# Altium schematic sheet Rx_syno.SchDoc: Balise IR-Rx - Synoptique
size A3; Author: B Labbe; CompanyName: Oufffteam; DrawnBy: B Labbe; Engineer: B Labbe; Organization: Oufffteam; Address1: L3, 12a Rodborough Rd; Address2: Frenchs Forest; Address3: NSW; Address4: Australia 2086; Revision: B; SheetNumber: 1; SheetTotal: 5; DocumentName: Balise IR-Rx - Synoptique
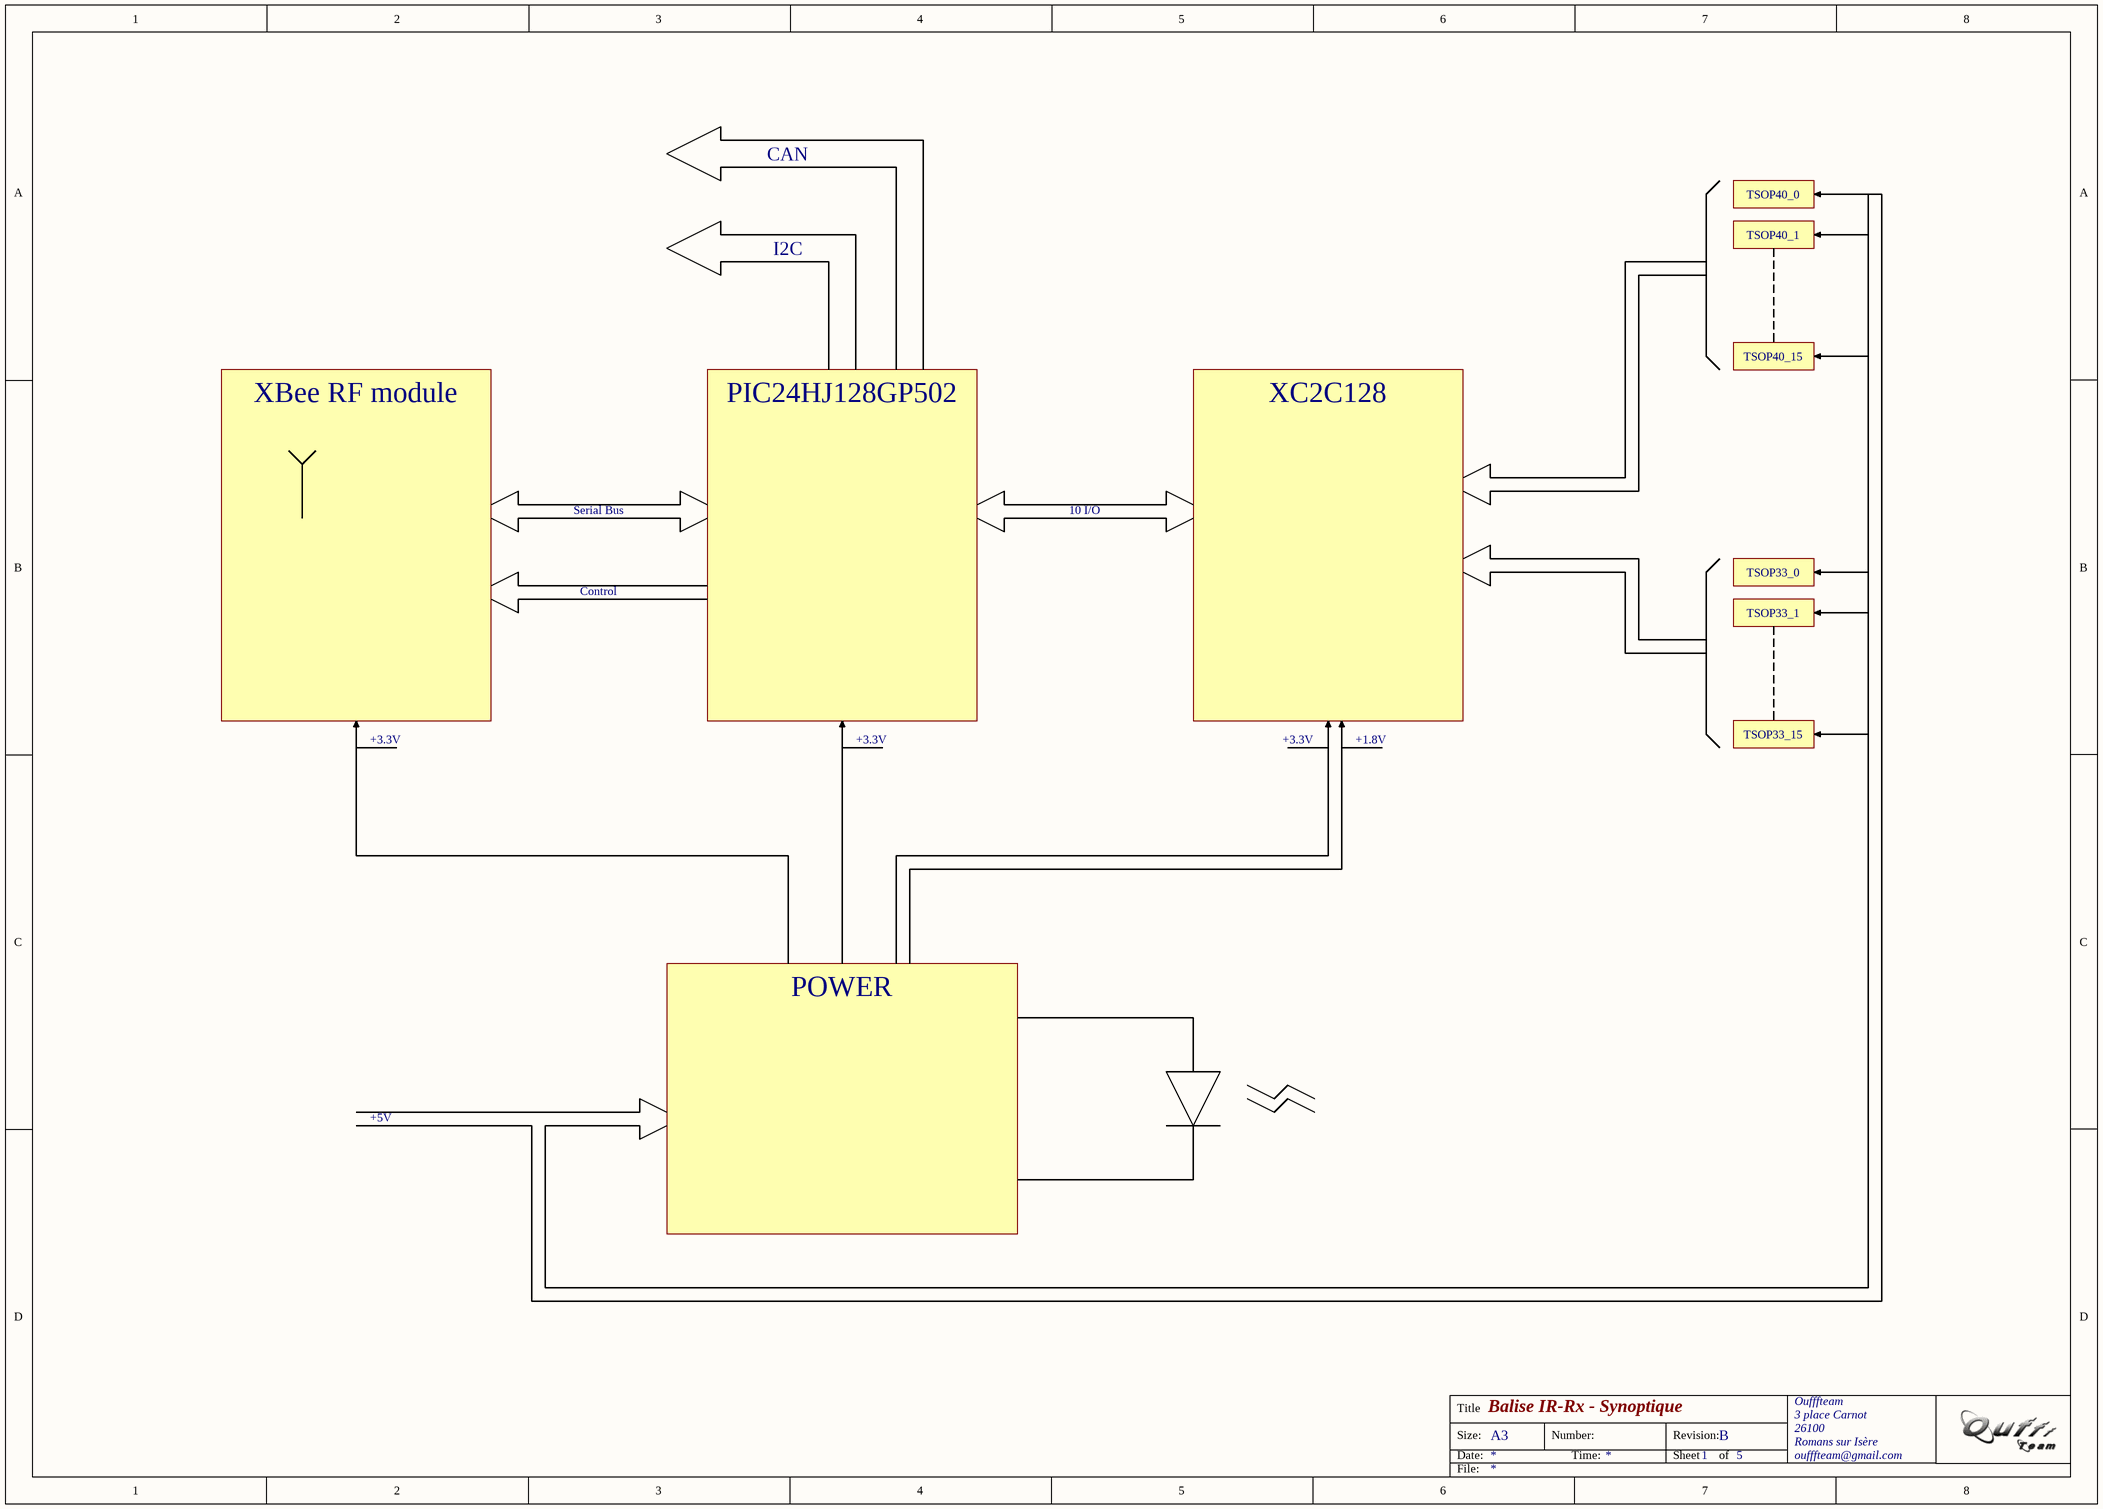
[diagram p0: Rx_syno.SchDoc]

## Notes on the sheet
- CAN
- I2C
- TSOP40_0
- TSOP40_1
- TSOP40_15
- XBee RF module
- PIC24HJ128GP502
- XC2C128
- Serial Bus
- 10 I/O
- TSOP33_0
- Control
- TSOP33_1
- +3.3V
- +1.8V
- TSOP33_15
- POWER
- +5V
- Title
- Size:
- Date:
- A3
- Number:
- Time:
- Revision:
- Sheet
- of
- Oufffteam
- 3 place Carnot
- 26100
- Romans sur Isère
- oufffteam@gmail.com
- File: